# Altium schematic sheet 5V_Power_Supply.SchDoc
size A; SheetNumber: 1; SheetTotal: 1; SPICEModelCacheTUJOLVIG: <root> / <DocumentId>TUJOLVIG</DocumentId> / <CacheFrame Number="0"> / <Model Name="bridge" Kind="CKT"> / <Text>*Default Diode Bridge Rectifier / *Connections: / *              V- / *              | AC1 / *              | | V+ / *              | | | AC2 / *              | | | | / .SUBCKT BRIDGE 1 2 3 4 / D1 1 2 DMOD / D2 1 4 DMOD / D3 2 3 DMOD / D4 4 3 DMOD / .MODEL DMOD D () / .ENDS BRIDGE</Text> / </Model> / </CacheFrame> / </root>
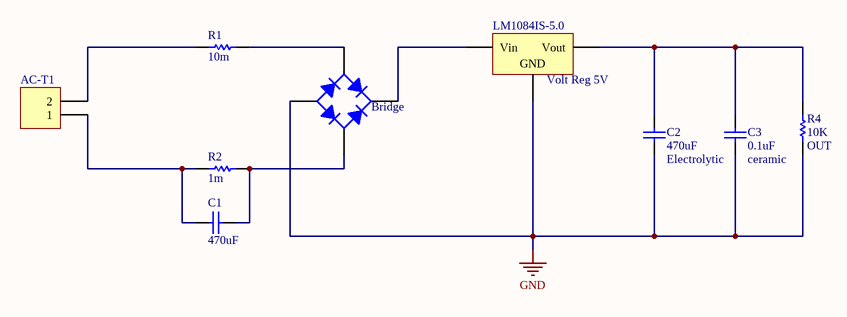
[diagram p0: 5V_Power_Supply.SchDoc]

## Parts
AC-T1  (no value)  [MHDR1X2]
Bridge  (no value)  [D-38]
C1  value 470uF  [RAD-0.3]
C2  Electrolytic  value 470uF  [RAD-0.3]
C3  ceramic  value 0.1uF  [RAD-0.3]
LM1084IS-5.0  Volt Reg 5V  [D2PAK_N]
R1  value 10m  [AXIAL-0.3]
R2  value 1m  [AXIAL-0.3]
R4  OUT  value 10K  [AXIAL-0.3]

## Nets
GND: Bridge.3(A) C2.1 C3.1 LM1084IS-5.0.2(GND) R4.1
NetAC-T1_1: AC-T1.1 C1.2 R2.2
NetAC-T1_2: AC-T1.2 R1.2
NetBridge_1: Bridge.1(K) LM1084IS-5.0.1(Vin)
NetBridge_2: Bridge.2(C) C1.1 R2.1
NetBridge_4: Bridge.4(C) R1.1
NetC2_2: C2.2 C3.2 LM1084IS-5.0.3(Vout) R4.2

## Library data of the parts
AC-T1 = MHDR1X2: Header, 2-Pin; LatestRevisionDate: 17-Jul-2002; LatestRevisionNote: Re-released for DXP Platform.; Publisher: Altium Limited
Bridge = Bridge1: Full Wave Diode Bridge; Published: 8-Jun-2000; LatestRevisionDate: 29-May-2009; LatestRevisionNote: Sch pins A & K swapped.; DatasheetVersion: E2732B; PackageReference: D-38; Publisher: Altium Limited; PackageDescription: Bridge Rectifier; 4 Terminals; Body 9.4 x 9.4 mm (typ); Pitch 5.08 mm
C1-C3 = Cap: Capacitor; Published: 8-Jun-2000; LatestRevisionDate: 17-Jul-2002; LatestRevisionNote: Re-released for DXP Platform.; PackageReference: RAD-0.3; Publisher: Altium Limited; PackageDescription: Radial Cap, Thru-Hole; 2 Leads; 0.3 in Pin Spacing
LM1084IS-5.0 = Volt Reg: Voltage Regulator; Published: 24-Mar-1999; LatestRevisionDate: 29-May-2009; LatestRevisionNote: IPC-7351 Footprint Added.; PackageReference: D2PAK; Publisher: Altium Limited; PackageDescription: 3-Pin Transistor Outline Package 2.54 mm Pitch, 15.1 mm Lead Span
R1 R2 R4 = Res1: Resistor; Published: 8-Jun-2000; LatestRevisionDate: 17-Jul-2002; LatestRevisionNote: Re-released for DXP Platform.; PackageReference: AXIAL-0.3; Publisher: Altium Limited; PackageDescription: Axial Device, Thru-Hole; 2 Leads; 0.3 in Pin Spacing